# EAGLE schematic square Rev1 (EAGLE 9.0.1)
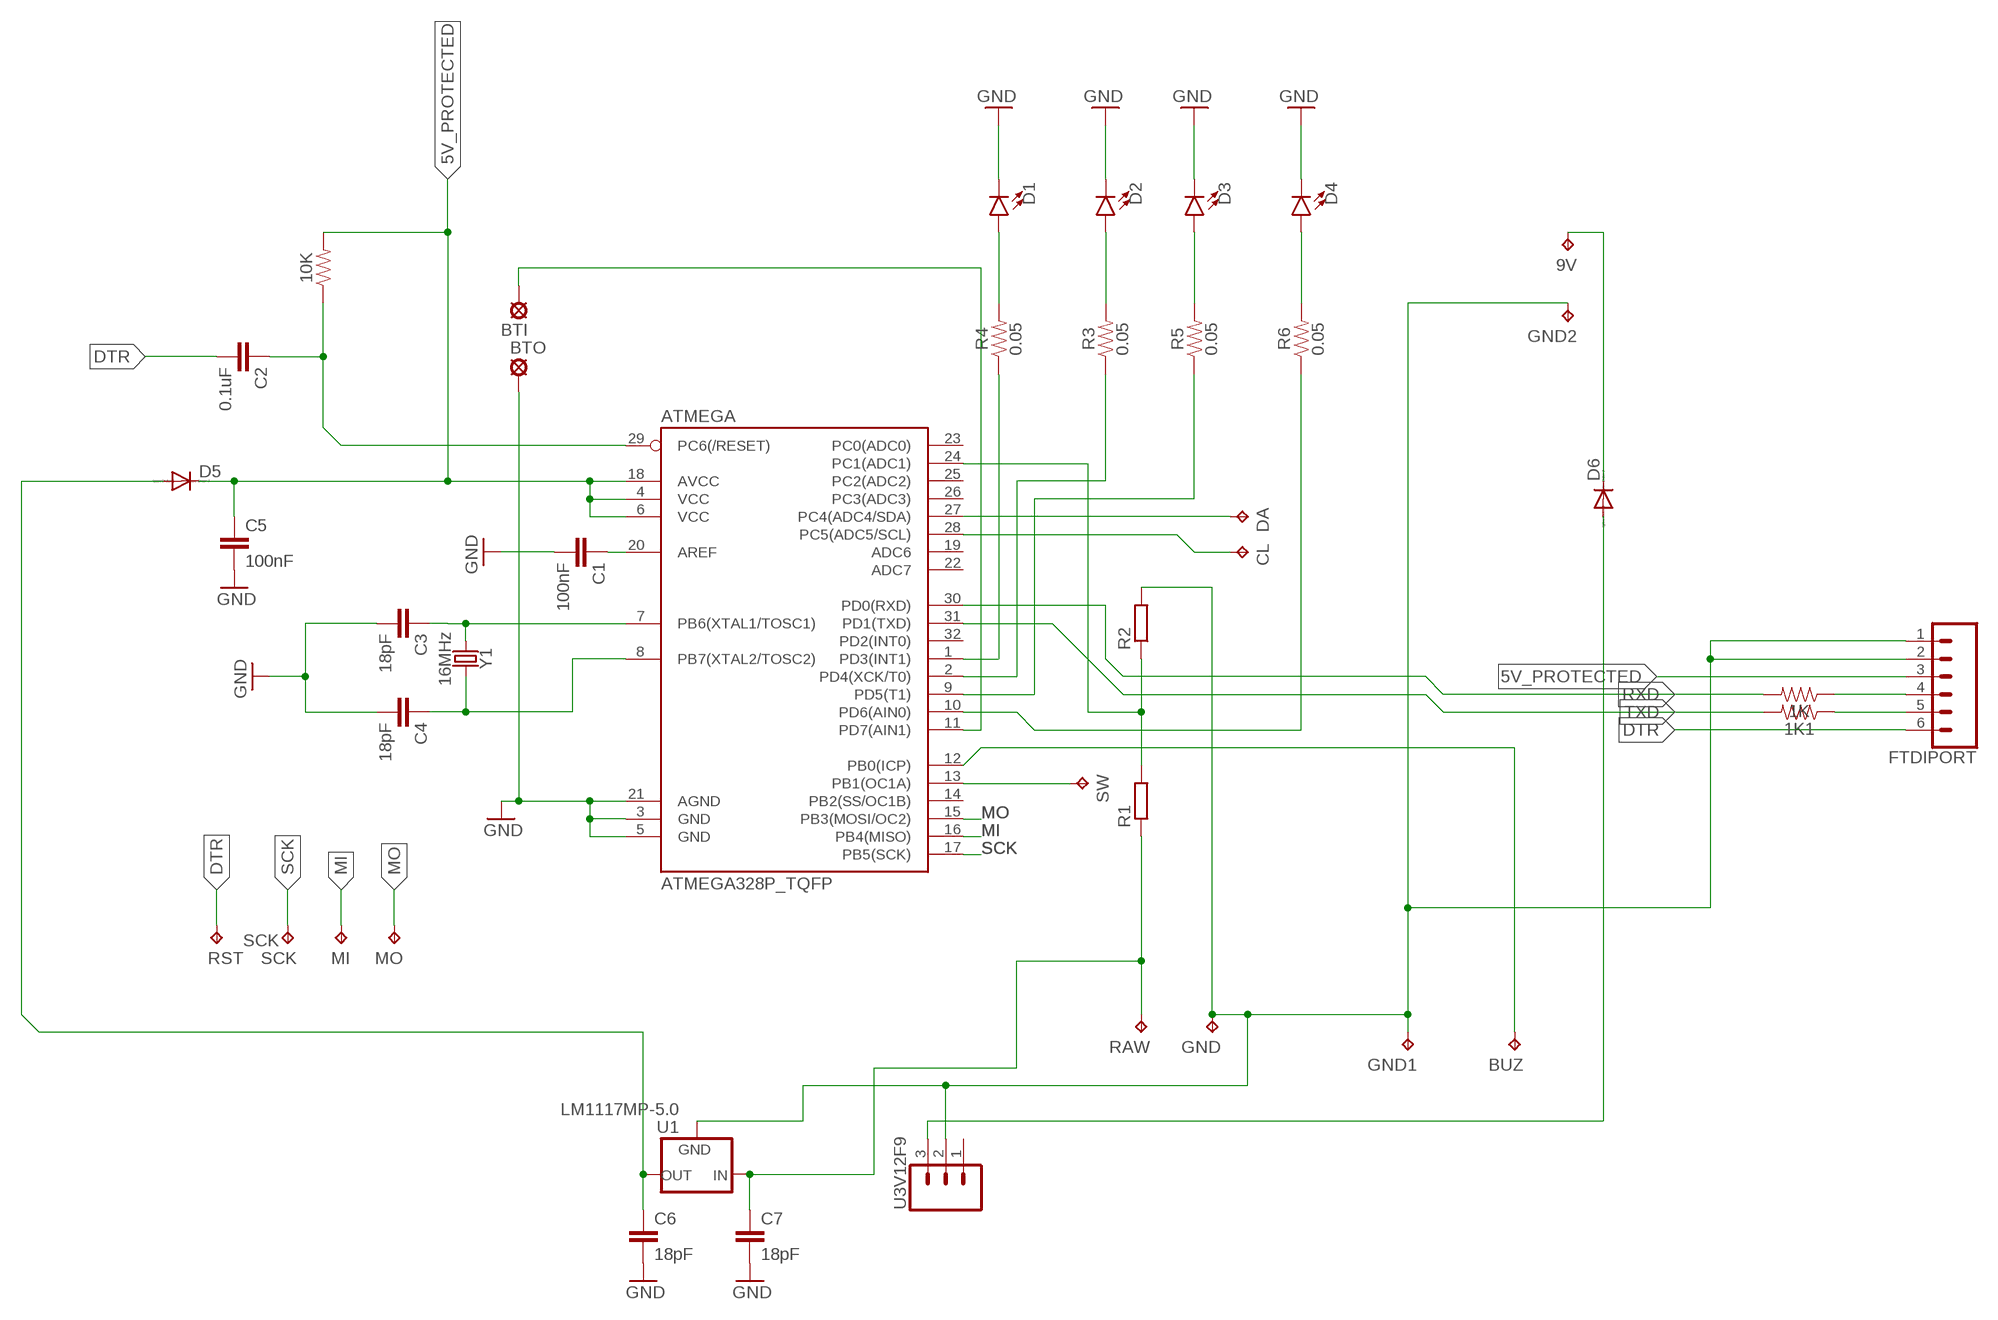
[diagram p0: schematic, sheet 1]

## Parts
1K  0.27OHM-0603-1/10W-1%  [0603]
1K1  0.27OHM-0603-1/10W-1%  [0603]
9V  TPB2,54  [B2,54]
10K  0.27OHM-0603-1/10W-1%  [0603]
ATMEGA  ATMEGA328P_TQFP  [TQFP32-08]
BTI  LSP10  [LSP10]
BTO  LSP10  [LSP10]
BUZ  TPB2,54  [B2,54]
C1  100nF  10NF-0603-50V-10%  [0603]
C2  0.1uF  10NF-0603-50V-10%  [0603]
C3  18pF  10NF-0603-50V-10%  [0603]
C4  18pF  10NF-0603-50V-10%  [0603]
C5  100nF  10NF-0603-50V-10%  [0603]
C6  18pF  10NF-0603-50V-10%  [0603]
C7  18pF  10NF-0603-50V-10%  [0603]
CL  TPB1,27  [B1,27]
D1  LED1206  [LED-1206]
D2  LED1206  [LED-1206]
D3  LED1206  [LED-1206]
D4  LED1206  [LED-1206]
D5  DIODE-SOD106A-R  [SOD106A-R]
D6  DIODE-SOD106A-R  [SOD106A-R]
DA  TPB1,27  [B1,27]
FTDIPORT  CONN_06SMD-1MM  [1X06-1MM]
GND  TPB2,54  [B2,54]
GND1  TPB2,54  [B2,54]
GND2  TPB2,54  [B2,54]
MI  TPB1,27  [B1,27]
MO  TPB1,27  [B1,27]
R1  R-EU_R1206  [R1206]
R2  R-EU_R1206  [R1206]
R3  0.05  0.05OHM-0603-1/5W-1%  [0603]
R4  0.05  0.05OHM-0603-1/5W-1%  [0603]
R5  0.05  0.05OHM-0603-1/5W-1%  [0603]
R6  0.05  0.05OHM-0603-1/5W-1%  [0603]
RAW  TPB2,54  [B2,54]
RST  TPB1,27  [B1,27]
SCK  TPB1,27  [B1,27]
SW  TPB1,27  [B1,27]
U1  LM1117MP-5.0  [SOT223]
U3V12F9  CONN_03  [1X03]
Y1  16MHz  CRYSTALSMD-5X3.2-2PAD  [CRYSTAL-SMD-5X3.2-2PAD]

## Nets
5V [power]: C6.1 D5.A U1.2(OUT) U1.4(OUT)
5V_PROTECTED [power]: 10K.2 ATMEGA.4(VCC) ATMEGA.6(VCC) ATMEGA.18(AVCC) C5.1 D5.C FTDIPORT.3
9VOUT [9v]: D6.A U3V12F9.3
AREF: ATMEGA.20(AREF) C1.1
BUTTON: ATMEGA.11(PD7(AIN1)) BTI.MP
BUZZER: ATMEGA.12(PB0(ICP)) BUZ.TP
DTR: C2.2 FTDIPORT.6 RST.TP
GND [power]: ATMEGA.3(GND) ATMEGA.5(GND) ATMEGA.21(AGND) BTO.MP C1.2 C3.2 C4.2 C5.2 C6.2 C7.2 D1.C D2.C D3.C D4.C FTDIPORT.1 FTDIPORT.2 GND1.TP GND2.TP GND.TP R2.2 U1.1(GND) U3V12F9.2
GREEN1: D2.A R3.2
GREEN2: D3.A R5.2
GREEN3: D4.A R6.2
LED1: ATMEGA.1(PD3(INT1)) R4.1
LED2: ATMEGA.2(PD4(XCK/T0)) R3.1
LED3: ATMEGA.9(PD5(T1)) R5.1
LED4: ATMEGA.10(PD6(AIN0)) R6.1
MI: ATMEGA.16(PB4(MISO)) MI.TP
MO: ATMEGA.15(PB3(MOSI/OC2)) MO.TP
N$1: 1K1.1 FTDIPORT.5
N$2: ATMEGA.13(PB1(OC1A)) SW.TP
N$3: 1K.1 FTDIPORT.4
N$21 [9v]: 9V.TP D6.C
RAW [9v]: C7.1 R1.1 RAW.TP U1.3(IN)
RED: D1.A R4.2
RESET: 10K.1 ATMEGA.29(PC6(/RESET)) C2.1
RXD: 1K.2 ATMEGA.30(PD0(RXD))
SCK: ATMEGA.17(PB5(SCK)) SCK.TP
SCL: ATMEGA.28(PC5(ADC5/SCL)) CL.TP
SDA: ATMEGA.27(PC4(ADC4/SDA)) DA.TP
TXD: 1K1.2 ATMEGA.31(PD1(TXD))
VOLTSENS: ATMEGA.24(PC1(ADC1)) R1.2 R2.1
XTAL1: ATMEGA.7(PB6(XTAL1/TOSC1)) C3.1 Y1.P$1
XTAL2: ATMEGA.8(PB7(XTAL2/TOSC2)) C4.1 Y1.P$2
Unconnected: ATMEGA.14(PB2(SS/OC1B)) ATMEGA.19(ADC6) ATMEGA.22(ADC7) ATMEGA.23(PC0(ADC0)) ATMEGA.25(PC2(ADC2)) ATMEGA.26(PC3(ADC3)) ATMEGA.32(PD2(INT0)) U3V12F9.1

## Library data of the parts
1K 1K1 10K = SparkFun-Resistors:0.27OHM: 0.27Ω resistor A resistor is a passive two-terminal electrical component that implements electrical resistance as a circuit element. Resistors act to reduce current flow, and, at the same time, act to lower voltage levels within circuits. - Wikipedia; PROD_ID: RES-08787; VALUE: 0.27
9V BUZ CL DA GND GND1 GND2 MI MO RAW RST SW = testpad:TP: Test pad
ATMEGA = SparkFun-IC-Microcontroller:ATMEGA328P_TQFP: Popular 328P in QFP Storefront component: ATmega328 - TQFP <https://www.sparkfun.com/products/13448> (COM-13448) Datasheet <http://www.sparkfun.com/datasheets/Components/SMD/ATMega328.pdf> SparkFun Products SparkFun RedBoard - Programmed with Arduino <https://www.sparkfun.com/products/12757> (DEV-12757) Arduino Pro Mini 328 - 5V/16MHz <https://www.sparkfun.com/products/11113> (DEV-11113) Arduino Pro Mini 328 - 3.3V/8MHz <https://www.sparkfun.com/products/11114> (DEV-11114) SparkFun OpenLog <https://www.sparkfun.com/products/13712> (DEV-13712) SparkFun MicroView - OLED Arduino Module <https://www.sparkfun.com/products/12923> (DEV-12923) SparkFun Digital Sandbox <https://www.sparkfun.com/products/12651> (DEV-12651) SparkFun PicoBoard <https://www.sparkfun.com/products/11888> (WIG-11888) Arduino Fio <https://www.sparkfun.com/products/10116> (DEV-10116) LilyPad Arduino 328 Main Board <https://www.sparkfun.com/products/13342> (DEV-13342) SparkFun RedStick <https://www.sparkfun.com/products/13741> (DEV-13741) LilyPad MP3 <https://www.sparkfun.com/products/11013> (DEV-11013) LilyPad Arduino SimpleSnap <https://www.sparkfun.com/products/10941> (DEV-10941) SparkFun Stepoko <https://www.sparkfun.com/products/13899> (ROB-13899) SparkFun Geiger Counter <https://www.sparkfun.com/products/11345> (SEN-11345) SparkFun EL Sequencer <https://www.sparkfun.com/products/12781> (COM-12781) Arduino Pro 328 - 5V/16MHz <https://www.sparkfun.com/products/10915> (DEV-10915) CryptoCape <https://www.sparkfun.com/products/12773> (DEV-12773) SparkFun IR Thermometer Evaluation Board - MLX90614 <https://www.sparkfun.com/products/10740> (SEN-10740) SparkFun RedBot Mainboard <https://www.sparkfun.com/products/12097> (ROB-12097) Arduino Pro 328 - 3.3V/8MHz <https://www.sparkfun.com/products/10914> (DEV-10914) SparkFun Block for Intel® Edison - Arduino <https://www.sparkfun.com/products/13036> (DEV-13036) SparkFun Simon Says - Surface Mount Soldering Kit <https://www.sparkfun.com/products/10935> (KIT-10935) SparkFun 7-Segment Serial Display - Red <https://www.sparkfun.com/products/11441> (COM-11441) SparkFun 7-Segment Serial Display - White <https://www.sparkfun.com/products/11629> (COM-11629) SparkFun 7-Segment Serial Display - Yellow <https://www.sparkfun.com/products/11443> (COM-11443) SparkFun 7-Segment Serial Display - Kelly Green <https://www.sparkfun.com/products/11440> (COM-11440) SparkFun 7-Segment Serial Display - Blue <https://www.sparkfun.com/products/11442> (COM-11442) SparkFun OpenSegment Serial Display - 20mm (Blue) <https://www.sparkfun.com/products/11647> (COM-11647) SparkFun OpenSegment Serial Display - 20mm (Green) <https://www.sparkfun.com/products/11646> (COM-11646) SparkFun OpenSegment Serial Display - 20mm (White) <https://www.sparkfun.com/products/11648> (COM-11648) SparkFun OpenSegment Serial Display - 20mm (Red) <https://www.sparkfun.com/products/11644> (COM-11644) SparkFun OpenSegment Serial Display - 20mm (Yellow) <https://www.sparkfun.com/products/11645> (COM-11645) SparkFun OpenSegment Shield <https://www.sparkfun.com/products/13190> (DEV-13190); PROD_ID: IC-09069
BTI BTO = solpad:LSP10: SOLDER PAD drill 1.0 mm, distributor Buerklin, 12H555
C1-C7 = SparkFun-Capacitors:10NF: 0.01uF/10nF/10,000pF ceramic capacitors A capacitor is a passive two-terminal electrical component used to store electrical energy temporarily in an electric field. CAP-09321; PROD_ID: CAP-00867; VALUE: 10nF
D1-D4 = SparkFun-LED:LED: LED (Generic) Standard schematic elements and footprints for 5mm, 3mm, 1206, and 0603 sized LEDs. Generic LEDs with no color specified.
D5 D6 = diode:DIODE-: DIODE
FTDIPORT = SparkFun-Connectors:CONN_06: Multi connection point. Often used as Generic Header-pin footprint for 0.1 inch spaced/style header connections On any of the 0.1 inch spaced packages, you can populate with these: Break Away Headers - Straight <https://www.sparkfun.com/products/116> (PRT-00116) Break Away Male Headers - Right Angle <https://www.sparkfun.com/products/553> (PRT-00553) Female Headers <https://www.sparkfun.com/products/115> (PRT-00115) Break Away Headers - Machine Pin <https://www.sparkfun.com/products/117> (PRT-00117) Break Away Female Headers - Swiss Machine Pin <https://www.sparkfun.com/products/743> (PRT-00743) Arduino Stackable Header - 6 Pin <https://www.sparkfun.com/products/9280> (PRT-09280) For SCREWTERMINALS and SPRING TERMINALS visit here: Screw Terimnals on SparkFun.com <https://www.sparkfun.com/search/results?term=Screw+Terminals> (5mm/3.5mm/2.54mm spacing) This device is also useful as a general connection point to wire up your design to another part of your project. Our various solder wires solder well into these plated through hole pads. Hook-Up Wire - Assortment (Stranded, 22 AWG) <https://www.sparkfun.com/products/11375> (PRT-11375) Hook-Up Wire - Assortment (Solid Core, 22 AWG) <https://www.sparkfun.com/products/11367> (PRT-11367) View the entire wire category on our website here <https://www.sparkfun.com/categories/141>; PROD_ID: CONN-08249; SF_ID: GPS-00579
R1 R2 = Clean-Kong:R-EU_: RESISTOR, European symbol
R3-R6 = SparkFun-Resistors:0.05OHM: 0.05Ω resistor A resistor is a passive two-terminal electrical component that implements electrical resistance as a circuit element. Resistors act to reduce current flow, and, at the same time, act to lower voltage levels within circuits. - Wikipedia; PROD_ID: RES-12535
SCK = testpad:TP: Test pad; TP_SIGNAL_NAME: SCK
U1 = lm1117_10:LM1117?-*: 800mA Low-Dropout Linear Regulator Source: http://www.ti.com/lit/ds/symlink/lm1117-n.pdf; MF: Texas Instruments; MPN: LM1117MP-5.0; OC_FARNELL: 9778209; OC_NEWARK: 28X3417
U3V12F9 = SparkFun-Connectors:CONN_03: Multi connection point. Often used as Generic Header-pin footprint for 0.1 inch spaced/style header connections On any of the 0.1 inch spaced packages, you can populate with these: Break Away Headers - Straight <https://www.sparkfun.com/products/116> (PRT-00116) Break Away Male Headers - Right Angle <https://www.sparkfun.com/products/553> (PRT-00553) Female Headers <https://www.sparkfun.com/products/115> (PRT-00115) Break Away Headers - Machine Pin <https://www.sparkfun.com/products/117> (PRT-00117) Break Away Female Headers - Swiss Machine Pin <https://www.sparkfun.com/products/743> (PRT-00743) Stackable Header - 3 Pin (Female, 0.1") <https://www.sparkfun.com/products/13875> (PRT-13875) For SCREWTERMINALS and SPRING TERMINALS visit here: Screw Terimnals on SparkFun.com <https://www.sparkfun.com/search/results?term=Screw+Terminals> (5mm/3.5mm/2.54mm spacing) This device is also useful as a general connection point to wire up your design to another part of your project. Our various solder wires solder well into these plated through hole pads. Hook-Up Wire - Assortment (Stranded, 22 AWG) <https://www.sparkfun.com/products/11375> (PRT-11375) Hook-Up Wire - Assortment (Solid Core, 22 AWG) <https://www.sparkfun.com/products/11367> (PRT-11367) View the entire wire category on our website here <https://www.sparkfun.com/categories/141> Special notes: Molex polarized connector foot print use with SKU : PRT-08232 with associated crimp pins and housings.
Y1 = SparkFun-Clocks:CRYSTAL: Crystals (Generic) These are passive quartz crystals, which can be used as a clock source for a microcontroller. Crystal's are two-terminal devices. They require external "load" capacitors to generate an oscillating signal.

## Net classes
0 default: width 0.2 mm, drill 0.254 mm, clearance 0.16 mm
1 power: width 0.2 mm, drill 0.254 mm, clearance 0.2 mm
2 9v: width 0.4 mm, drill 0.254 mm, clearance 0.3 mm